# Altium schematic sheet STM32F407.SchDoc
size A; SheetNumber: 4; SheetTotal: 11
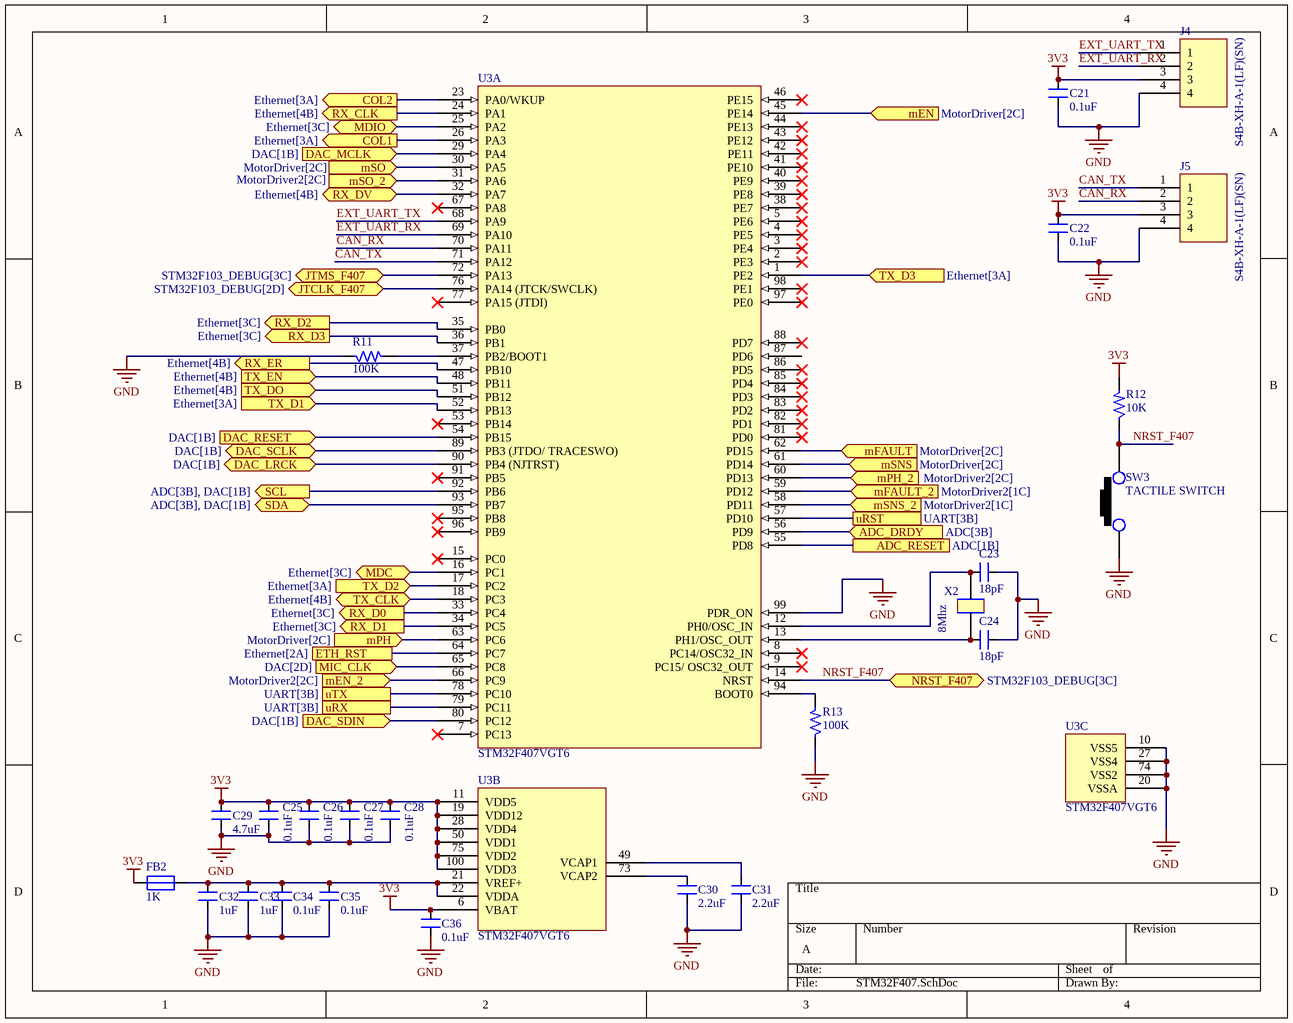
[diagram p0: STM32F407.SchDoc]

## Parts
C21  0.1uF  [CAP_0805]
C22  0.1uF  [CAP_0805]
C23  18pF  [CAP_0805]
C24  18pF  [CAP_0805]
C25  0.1uF  [CAP_0805]
C26  0.1uF  [CAP_0805]
C27  0.1uF  [CAP_0805]
C28  0.1uF  [CAP_0805]
C29  4.7uF  [CAP_0805]
C30  2.2uF  [CAP_0805]
C31  2.2uF  [CAP_0805]
C32  1uF  [CAP_0805]
C33  1uF  [CAP_0805]
C34  0.1uF  [CAP_0805]
C35  0.1uF  [CAP_0805]
C36  0.1uF  [CAP_0805]
FB2  1K  [IND_0805]
J4  S4B-XH-A-1(LF)(SN)  [CON4_100_S4B-XH-A_TH_RA]
J5  S4B-XH-A-1(LF)(SN)  [CON4_100_S4B-XH-A_TH_RA]
R11  100K  [RES_0805]
R12  10K  [RES_0603]
R13  100K  [RES_0805]
SW3  TACTILE SWITCH  [SW_342_SMD]
U3  STM32F407VGT6  [QFN100_19.6_669_58X10_SMD]  (parts A,B,C of 3)
X2  8Mhz  [XTAL_314_240X47_SMD]

## Ports
ADC_DRDY (in, see ADC[3B]), ADC_RESET (see ADC[1B]), COL1 (out, see Ethernet[3A]), COL2 (out, see Ethernet[3A]), DAC_LRCK (bidir, see DAC[1B]), DAC_MCLK (in, see DAC[1B]), DAC_RESET (in, see DAC[1B]), DAC_SCLK (bidir, see DAC[1B]), DAC_SDIN (in, see DAC[1B]), ETH_RST (see Ethernet[2A]), JTCLK_F407 (bidir, see STM32F103_DEBUG[2D]), JTMS_F407 (bidir, see STM32F103_DEBUG[3C]), MDC (bidir, see Ethernet[3C]), MDIO (bidir, see Ethernet[3C]), mEN (in, see MotorDriver[2C]), mEN_2 (in, see MotorDriver2[2C]), mFAULT (in, see MotorDriver[2C]), mFAULT_2 (in, see MotorDriver2[1C]), MIC_CLK (in, see DAC[2D]), mPH (in, see MotorDriver[2C]), mPH_2 (in, see MotorDriver2[2C]), mSNS (in, see MotorDriver[2C]), mSNS_2 (in, see MotorDriver2[1C]), mSO (in, see MotorDriver[2C]), mSO_2 (in, see MotorDriver2[2C]), NRST_F407 (bidir, see STM32F103_DEBUG[3C]), RX_CLK (out, see Ethernet[4B]), RX_D0 (out, see Ethernet[3C]), RX_D1 (out, see Ethernet[3C]), RX_D2 (out, see Ethernet[3C]), RX_D3 (out, see Ethernet[3C]), RX_DV (bidir, see Ethernet[4B]), RX_ER (out, see Ethernet[4B]), SCL (out, see ADC[3B], DAC[1B]), SDA (bidir, see ADC[3B], DAC[1B]), TX_CLK (bidir, see Ethernet[4B]), TX_D1 (in, see Ethernet[3A]), TX_D2 (in, see Ethernet[3A]), TX_D3 (in, see Ethernet[3A]), TX_DO (in, see Ethernet[4B]), TX_EN (in, see Ethernet[4B]), uRST (see UART[3B]), uRX (see UART[3B]), uTX (see UART[3B])

## Nets
3V3: C21.2 C22.2 C25.2 C26.2 C27.2 C28.2 C29.1 C36.2 FB2.1 J4.3 J5.3 R12.2 U3.6(VBAT) U3.11(VDD5) U3.19(VDD12) U3.28(VDD4) U3.50(VDD1) U3.75(VDD2) U3.100(VDD3)
GND: C21.1 C22.1 C23.2 C24.2 C25.1 C26.1 C27.1 C28.1 C29.2 C30.2 C31.1 C32.1 C33.1 C34.1 C35.1 C36.1 J4.4 J5.4 R11.1 R13.1 SW3.1 U3.10(VSS5) U3.20(VSSA) U3.27(VSS4) U3.74(VSS2) U3.99(PDR_ON)
ADC_DRDY: U3.56(PD9) ; port ADC_DRDY
ADC_RESET: U3.55(PD8) ; port ADC_RESET
CAN_RX: J5.2 U3.70(PA11)
CAN_TX: J5.1 U3.71(PA12)
COL1: U3.26(PA3) ; port COL1
COL2: U3.23(PA0/WKUP) ; port COL2
DAC_LRCK: U3.90(PB4_(NJTRST)) ; port DAC_LRCK
DAC_MCLK: U3.29(PA4) ; port DAC_MCLK
DAC_RESET: U3.54(PB15) ; port DAC_RESET
DAC_SCLK: U3.89(PB3_(JTDO/_TRACESWO)) ; port DAC_SCLK
DAC_SDIN: U3.80(PC12) ; port DAC_SDIN
ETH_RST: U3.64(PC7) ; port ETH_RST
EXT_UART_RX: J4.2 U3.69(PA10)
EXT_UART_TX: J4.1 U3.68(PA9)
JTCLK_F407: U3.76(PA14_(JTCK/SWCLK)) ; port JTCLK_F407
JTMS_F407: U3.72(PA13) ; port JTMS_F407
MDC: U3.16(PC1) ; port MDC
MDIO: U3.25(PA2) ; port MDIO
mEN: U3.45(PE14) ; port mEN
mEN_2: U3.66(PC9) ; port mEN_2
mFAULT: U3.62(PD15) ; port mFAULT
mFAULT_2: U3.59(PD12) ; port mFAULT_2
MIC_CLK: U3.65(PC8) ; port MIC_CLK
mPH: U3.63(PC6) ; port mPH
mPH_2: U3.60(PD13) ; port mPH_2
mSNS: U3.61(PD14) ; port mSNS
mSNS_2: U3.58(PD11) ; port mSNS_2
mSO: U3.30(PA5) ; port mSO
mSO_2: U3.31(PA6) ; port mSO_2
NRST_F407: R12.1 SW3.2 U3.14(NRST) ; port NRST_F407
RX_CLK: U3.24(PA1) ; port RX_CLK
RX_D0: U3.33(PC4) ; port RX_D0
RX_D1: U3.34(PC5) ; port RX_D1
RX_D2: U3.35(PB0) ; port RX_D2
RX_D3: U3.36(PB1) ; port RX_D3
RX_DV: U3.32(PA7) ; port RX_DV
RX_ER: U3.47(PB10) ; port RX_ER
SCL: U3.92(PB6) ; port SCL
SDA: U3.93(PB7) ; port SDA
TX_CLK: U3.18(PC3) ; port TX_CLK
TX_D1: U3.52(PB13) ; port TX_D1
TX_D2: U3.17(PC2) ; port TX_D2
TX_D3: U3.1(PE2) ; port TX_D3
TX_DO: U3.51(PB12) ; port TX_DO
TX_EN: U3.48(PB11) ; port TX_EN
uRST: U3.57(PD10) ; port uRST
uRX: U3.79(PC11) ; port uRX
uTX: U3.78(PC10) ; port uTX
NetC23_1: C23.1 U3.12(PH0/OSC_IN) X2.2
NetC24_1: C24.1 U3.13(PH1/OSC_OUT) X2.1
NetC30_1: C30.1 U3.73(VCAP2)
NetC31_2: C31.2 U3.49(VCAP1)
NetC32_2: C32.2 C33.2 C34.2 C35.2 FB2.2 U3.21(VREF+) U3.22(VDDA)
NetR11_2: R11.2 U3.37(PB2/BOOT1)
NetR13_2: R13.2 U3.94(BOOT0)

Not connected (* = marked no-connect by the designer): U3 2(PE3)* 3(PE4)* 4(PE5)* 5(PE6)* 7(PC13)* 8(PC14/OSC32_IN)* 9(PC15/_OSC32_OUT)* 15(PC0)* 38(PE7)* 39(PE8)* 40(PE9)* 41(PE10)* 42(PE11)* 43(PE12)* 44(PE13)* 46(PE15)* 53(PB14)* 67(PA8)* 77(PA15_(JTDI))* 81(PD0)* 82(PD1)* 83(PD2)* 84(PD3)* 85(PD4)* 86(PD5)* 87(PD6) 88(PD7)* 91(PB5)* 95(PB8)* 96(PB9)* 97(PE0)* 98(PE1)*

## Library data of the parts
C21 C22 C25-C28 C34-C36 = CAP_0.1uF-50V-5%-0805: 0.1µF ±5% 50V Ceramic Capacitor X7R 0805 (2012 Metric); Manufacturer: AVX Corporation; Manufacturer Part Number: 08055C104JAT4A; Alternate Part Number-1: 0805B104M500; Case/Package: 0805; Supplier-1: SIRICOM; Supplier Part Number-1: 0805B104J500CT
C23 C24 = CAP_18pF-50V-5%-0805: 18pF ±5% 50V Ceramic Capacitor C0G, NP0 0805 (2012 Metric); Manufacturer: Yageo; Manufacturer Part Number: CL21C180JBANNNC; Alternate Part Number-1: NA; Case/Package: 0805; Supplier-1: NA; Supplier Part Number-1: NA
C29 = CAP_4.7uF-50V-10%-0805: 4.7µF ±10% 50V Ceramic Capacitor X5R 0805 (2012 Metric); Manufacturer: Yageo; Manufacturer Part Number: GRM21BR61H475KE51L; Alternate Part Number-1: NA; Case/Package: 0805; Supplier-1: SIRICOM; Supplier Part Number-1: CL21A475KBQNNNE
C30 C31 = CAP_2.2uF-25V-10%-0805: 2.2µF ±10% 25V Ceramic Capacitor X7R 0805 (2012 Metric); Manufacturer: KEMET; Manufacturer Part Number: CL21B225KAFNFNE; Alternate Part Number-1: NA; Case/Package: 0805; Supplier-1: SIRICOM; Supplier Part Number-1: CL21A225KAFNNNE
C32 C33 = CAP_1uF-50V-5%-0805: 1µF ±5% 50V Ceramic Capacitor X7R 0805 (2012 Metric); Manufacturer: Samsung; Manufacturer Part Number: CC0805JKX7R9BB105; Alternate Part Number-1: 0805F105M500NT; Case/Package: 0805; Supplier-1: SIRICOM; Supplier Part Number-1: CL21B105KBFNNNE
FB2 = FB_1K-100MHZ-1.6A-0805: 1 kOhms @ 100MHz 1 Power Line Ferrite Bead 0805 (2012 Metric) 1.6A; Manufacturer: Laird; Manufacturer Part Number: BLM21SP102SH1D; Alternate Part Number-1: NA; Case/Package: 0805; Supplier-1: SIRICOM; Supplier Part Number-1: ACMS201209A102
J4 J5 = CON-PLG_4X1-100-RA-TH: 4 Pins, 1 Row 2.54mm Pitch, right angle Connector, male; Manufacturer: Wurth Electronics; Mating Part Number: XHP-4; Crimp Part Number: ASXHSXH22K51; Alternate Part Number-1: NA; Manufacturer Part Number: S4B-XH-A-1(LF)(SN); Case/Package: TH-CON; Supplier-1: LCSC; Supplier Part Number-1: S4B-XH-A
R11 R13 = RES_100K-0.125W-1%-0805: 100 kOhms ±1% 0.125W, 1/8W Chip Resistor 0805 (2012 Metric) Automotive AEC-Q200 Thick Film; Manufacturer: Walsin; Manufacturer Part Number: WR08X1003FTL; Alternate Part Number-1: NA; Case/Package: 0805; Supplier-1: SIRICOM; Supplier Part Number-1: WR08X1003FTL
R12 = RES_10K-0.1W-1%-0603: 10 kOhms ±1% 0.1W, 1/10W Chip Resistor 0603 (1608 Metric) Automotive AEC-Q200 Thick Film; Manufacturer: Walsin; Manufacturer Part Number: WR06X1002FTL; Alternate Part Number-1: 0603WAJ0103T5E; Case/Package: 0603; Supplier-1: SIRICOM; Supplier Part Number-1: WR06X1002FTL
SW3 = SW1_RS-282G05A3-SMRT-SMD: Tactile Switch SPST-NO Top Actuated Surface Mount; Manufacturer: ITT C&K; Alternate Part Number-1: NA; Manufacturer Part Number: RS-282G05A3-SMRT; Case/Package: SMD; Supplier-1: SP ROAD; Supplier Part Number-1: RS-282G05A3-SMRT
U3 = IC_STM32F407VGT6: ARM® Cortex®-M4 STM32F4 Microcontroller IC 32-Bit 168MHz 1MB (1M x 8) FLASH 100-LQFP (14x14); Manufacturer: STMicroelectronics; Alternate Part Number-1: STM32F407VET6; Manufacturer Part Number: STM32F407VGT6; Case/Package: LQFP100; Supplier-1: ARROW; Supplier Part Number-1: STM32F407VGT6
X2 = XTAL_8MHZ-ECS-80-32-5PX-SMD: 8MHz ±30ppm Crystal 32pF 60 Ohms HC-49/US; Manufacturer: Fox Electronics; Manufacturer Part Number: ECS-80-32-5PX-TR; Alternate Part Number-1: NA; Case/Package: SMD/SMT; Supplier-1: SP ROAD; Supplier Part Number-1: ECS-80-32-5PX-TR